# EAGLE design ESP32 IMU Module V1.1 (EAGLE 6.1)
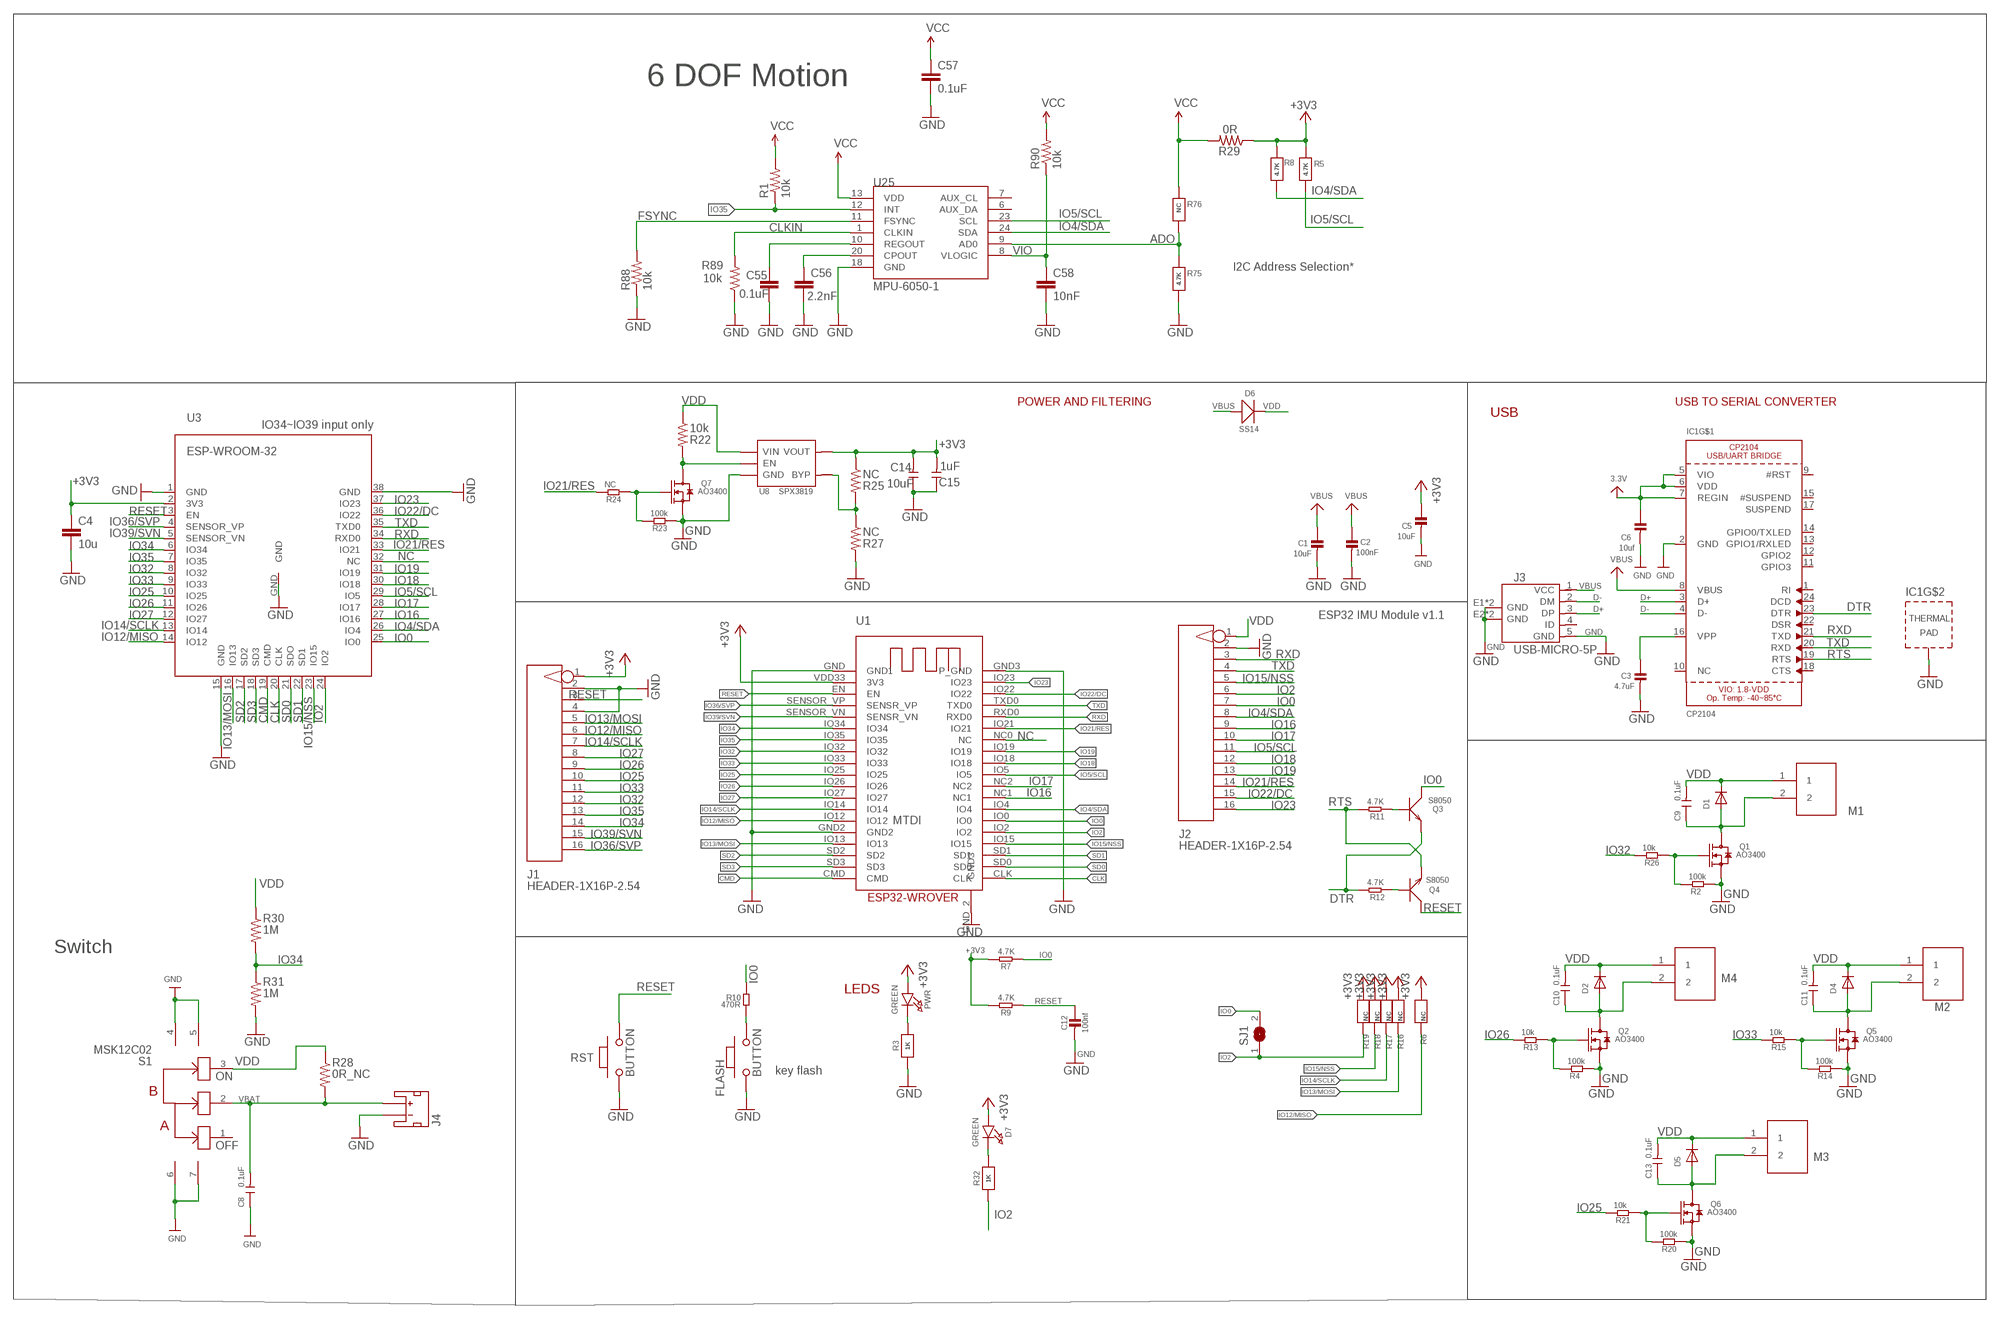
[diagram p0: schematic, sheet 1]

## Parts
C1  10uF  CAP_CERAMIC0603_NO  [0603-NO]
C2  100nF  CAP_CERAMIC0603_NO  [0603-NO]
C3  4.7uF  CAP_CERAMIC0603_NO  [0603-NO]
C4  10u  C-EUC0603  [C0603]
C5  10uF  CAP_CERAMIC0603_NO  [0603-NO]
C6  10uf  CAP_CERAMIC0603_NO  [0603-NO]
C8  0.1uF  C-0603  [0603]
C9  0.1uF  C-0603  [0603]
C10  0.1uF  C-0603  [0603]
C11  0.1uF  C-0603  [0603]
C12  100nf  CAP_CERAMIC0603_NO  [0603-NO]
C13  0.1uF  C-0603  [0603]
C14  10uF  C-0603  [0603]
C15  1uF  C-0603  [0603]
C55  0.1uF  CAP0603-CAP  [0603-CAP]
C56  2.2nF  CAP0603-CAP  [0603-CAP]
C57  0.1uF  CAP0603-CAP  [0603-CAP]
C58  10nF  CAP0603-CAP  [0603-CAP]
D1  DIODESOD-323F  [SOD-323F]
D2  DIODESOD-323F  [SOD-323F]
D4  DIODESOD-323F  [SOD-323F]
D5  DIODESOD-323F  [SOD-323F]
D6  SS14  D'0805'  [SOD323]
D7  GREEN  LED0805_NOOUTLINE  [CHIPLED_0805_NOOUTLINE]
FLASH  BUTTON  PB157  [157SW]
IC1  CP2104  [QFN24_4MM_SMSC]
J1  HEADER-1X16P-2.54  [DIP-1X16-2.54MM]
J2  HEADER-1X16P-2.54  [DIP-1X16-2.54MM]
J3  USB-MICRO-5P  [MICRO-USB-5P]
J4  JST_2MM_MALESMD  [JST-2-SMD]
M1  PH2.0-2P-90-DIP  [PH2.0-2P-90-DIP]
M2  PH2.0-2P-90-DIP  [PH2.0-2P-90-DIP]
M3  PH2.0-2P-90-DIP  [PH2.0-2P-90-DIP]
M4  PH2.0-2P-90-DIP  [PH2.0-2P-90-DIP]
PWR  GREEN  LED0805_NOOUTLINE  [CHIPLED_0805_NOOUTLINE]
Q1  AO3400  MOSFET-N'SOT23'  [SOT23@1]
Q2  AO3400  MOSFET-N'SOT23'  [SOT23@1]
Q3  S8050  TRANSISTOR-NPN-SOT23  [SOT23]
Q4  S8050  TRANSISTOR-NPN-SOT23  [SOT23]
Q5  AO3400  MOSFET-N'SOT23'  [SOT23@1]
Q6  AO3400  MOSFET-N'SOT23'  [SOT23@1]
Q7  AO3400  MOSFET-N'SOT23'  [SOT23@1]
R1  10k  RESISTOR0603-RES  [0603-RES]
R2  100k  R-0603  [R0603]
R3  1K  RESISTOR_0603_NOOUT  [0603-NO]
R4  100k  R-0603  [R0603]
R5  4.7K  RESISTOR_0603_NOOUT  [0603-NO]
R6  NC  RESISTOR_0603_NOOUT  [0603-NO]
R7  4.7K  R-0603  [R0603]
R8  4.7K  RESISTOR_0603_NOOUT  [0603-NO]
R9  4.7K  R-0603  [R0603]
R10  470R  R-0603  [R0603]
R11  4.7K  R-0603  [R0603]
R12  4.7K  R-0603  [R0603]
R13  10k  R-0603  [R0603]
R14  100k  R-0603  [R0603]
R15  10k  R-0603  [R0603]
R16  NC  RESISTOR_0603_NOOUT  [0603-NO]
R17  NC  RESISTOR_0603_NOOUT  [0603-NO]
R18  NC  RESISTOR_0603_NOOUT  [0603-NO]
R19  NC  RESISTOR_0603_NOOUT  [0603-NO]
R20  100k  R-0603  [R0603]
R21  10k  R-0603  [R0603]
R22  10k  RESISTOR0603-RES  [0603-RES]
R23  100k  R-0603  [R0603]
R24  NC  R-0603  [R0603]
R25  NC  RESISTOR0603-RES  [0603-RES]
R26  10k  R-0603  [R0603]
R27  NC  RESISTOR0603-RES  [0603-RES]
R28  0R_NC  RESISTOR0603-RES  [0603-RES]
R29  0R  RESISTOR0603-RES  [0603-RES]
R30  1M  RESISTOR0603-RES  [0603-RES]
R31  1M  RESISTOR0603-RES  [0603-RES]
R32  1K  RESISTOR_0603_NOOUT  [0603-NO]
R75  4.7K  RESISTOR_0603_NOOUT  [0603-NO]
R76  NC  RESISTOR_0603_NOOUT  [0603-NO]
R88  10k  RESISTOR0603-RES  [0603-RES]
R89  10k  RESISTOR0603-RES  [0603-RES]
R90  10k  RESISTOR0603-RES  [0603-RES]
RST  BUTTON  PB157  [157SW]
S1  MSK12C02  [SMD7-6.6X2.7X2.5MM]
SJ1  SJ  [SJ]
U1  ESP32-WROVER  [ESP32-WROVER]
U3  ESP-WROOM-32  [ESP-WROOM-32]
U8  SPX3819  [SOT23-5]
U25  MPU-6050-1  [QFN-24-4MM2]

## Nets
+3V3: C4.1 C5.1 C6.1 C14.2 C15.2 D7.A IC1.5(VIO) IC1.6(VDD) IC1.7(REGIN) J1.1 PWR.A R5.1 R6.1 R7.2 R8.1 R9.2 R16.1 R17.1 R18.1 R19.1 R25.1 R29.1 U1.VDD33(3V3) U3.2(3V3) U8.5(VOUT) ; supply symbol labelled 3.3V
ADO: R75.1 R76.2 U25.9(AD0)
CLK: U1.CLK U3.20(CLK)
CLKIN: R89.2 U25.1(CLKIN)
CMD: U1.CMD U3.19(CMD)
D+: IC1.3(D+) J3.3(DP)
D-: IC1.4(D-) J3.2(DM)
DTR: IC1.23(DTR) Q3.2(E) R12.2
FSYNC: R88.2 U25.11(FSYNC)
GND: C1.2 C2.2 C3.2 C4.2 C5.2 C6.2 C8.1 C12.2 C14.1 C15.1 C55.2 C56.2 C57.2 C58.2 FLASH.1 IC1.2(GND) IC1.THERM(TP) J1.2 J1.4 J2.2 J3.5(GND) J3.E1(GND) J3.E2(GND) J3.P1(GND) J3.P2(GND) J4.1(-) Q1.2(S) Q2.2(S) Q5.2(S) Q6.2(S) Q7.2(S) R2.1 R3.1 R4.1 R14.1 R20.1 R23.1 R27.2 R31.2 R75.2 R88.1 R89.1 RST.1 S1.4 S1.5 S1.6 S1.7 U1.GND2 U1.GND3(P_GND) U1.GND(GND1) U1.GND_2(GND3) U3.1(GND) U3.15(GND) U3.38(GND) U3.GND U8.2(GND) U25.18(GND)
IO0: J2.7 Q3.3(C) R7.1 R10.2 SJ1.2 U1.IO0 U3.25(IO0)
IO2: J2.6 R19.2 R32.1 SJ1.1 U1.IO2 U3.24(IO2)
IO4/SDA: J2.8 R8.2 U1.IO4 U3.26(IO4) U25.24(SDA)
IO5/SCL: J2.11 R5.2 U1.IO5 U3.29(IO5) U25.23(SCL)
IO12/MISO: J1.6 R6.2 U1.IO12 U3.14(IO12)
IO13/MOSI: J1.5 R16.2 U1.IO13 U3.16(IO13)
IO14/SCLK: J1.7 R17.2 U1.IO14 U3.13(IO14)
IO15/NSS: J2.5 R18.2 U1.IO15 U3.23(IO15)
IO16: J2.9 U1.NC1 U3.27(IO16)
IO17: J2.10 U1.NC2 U3.28(IO17)
IO18: J2.12 U1.IO18 U3.30(IO18)
IO19: J2.13 U1.IO19 U3.31(IO19)
IO21/RES: J2.14 R24.2 U1.IO21 U3.33(IO21)
IO22/DC: J2.15 U1.IO22 U3.36(IO22)
IO23: J2.16 U1.IO23 U3.37(IO23)
IO25: J1.10 R21.2 U1.IO25 U3.10(IO25)
IO26: J1.9 R13.2 U1.IO26 U3.11(IO26)
IO27: J1.8 U1.IO27 U3.12(IO27)
IO32: J1.12 R26.2 U1.IO32 U3.8(IO32)
IO33: J1.11 R15.2 U1.IO33 U3.9(IO33)
IO34: J1.14 R30.2 R31.1 U1.IO34 U3.6(IO34)
IO35: J1.13 R1.1 U1.IO35 U3.7(IO35) U25.12(INT)
IO36/SVP: J1.16 U1.SENSOR_VP(SENSR_VP) U3.4(SENSOR_VP)
IO39/SVN: J1.15 U1.SENSOR_VN(SENSR_VN) U3.5(SENSOR_VN)
N$1: C9.1 D1.A M1.2 Q1.3(D)
N$2: Q2.1(G) R4.2 R13.1
N$3: C10.1 D2.A M4.2 Q2.3(D)
N$4: Q1.1(G) R2.2 R26.1
N$5: PWR.C R3.2
N$6: Q5.1(G) R14.2 R15.1
N$7: C11.1 D4.A M2.2 Q5.3(D)
N$8: Q6.1(G) R20.2 R21.1
N$9: C13.1 D5.A M3.2 Q6.3(D)
N$10: Q7.3(D) R22.2 U8.3(EN)
N$11: Q7.1(G) R23.2 R24.1
N$12: D7.C R32.2
N$13: Q4.1(B) R12.1
N$14: Q3.1(B) R11.1
N$15: FLASH.2 R10.1
N$17: R25.2 R27.1 U8.4(BYP)
N$49: C56.1 U25.20(CPOUT)
N$50: C55.1 U25.10(REGOUT)
NC: U1.NC0(NC) U3.32(NC)
RESET: C12.1 J1.3 Q4.3(C) R9.1 RST.2 U1.EN U3.3(EN)
RTS: IC1.19(RTS) Q4.2(E) R11.2
RXD: IC1.21(TXD) J2.3 U1.RXD0 U3.34(RXD0)
SD0: U1.SD0 U3.21(SDO)
SD1: U1.SD1 U3.22(SD1)
SD2: U1.SD2 U3.17(SD2)
SD3: U1.SD3 U3.18(SD3)
TXD: IC1.20(RXD) J2.4 U1.TXD0 U3.35(TXD0)
VBAT: C8.2 J4.2(+) R28.2 S1.2
VBUS: C1.1 C2.1 D6.+ IC1.8(VBUS) J3.1(VCC)
VBUS1: C3.1 IC1.16(VPP)
VCC: C57.1 R1.2 R29.2 R76.1 R90.2 U25.13(VDD)
VDD: C9.2 C10.2 C11.2 C13.2 D1.C D2.C D4.C D5.C D6.- J2.1 M1.1 M2.1 M3.1 M4.1 R22.1 R28.1 R30.1 S1.3 U8.1(VIN)
VIO: C58.1 R90.1 U25.8(VLOGIC)
Unconnected: IC1.1(RI) IC1.9(#RST) IC1.10(NC) IC1.11(GPIO3) IC1.12(GPIO2) IC1.13(GPIO1/RXLED) IC1.14(GPIO0/TXLED) IC1.15(#SUSPEND) IC1.17(SUSPEND) IC1.18(CTS) IC1.22(DSR) IC1.24(DCD) J3.4(ID) S1.1 U25.6(AUX_DA) U25.7(AUX_CL)

## Notes on the sheet
- 6 DOF Motion
- I2C Address Selection*
- POWER AND FILTERING | USB TO SERIAL CONVERTER
- USB
- IO34~IO39 input only
- ESP32 IMU Module v1.1
- M1
- MTDI
- Switch
- M4
- LEDS
- M2
- key flash
- ON
- OFF
- M3

## Library data of the parts
C1-C3 C5 C6 C12 = microbuilder:CAP_CERAMIC: Ceramic Capacitors For new designs, use the packages preceded by an '_' character since they are more reliable: The following footprints should be used on most boards: _0402 - Standard footprint for regular board layouts _0603 - Standard footprint for regular board layouts _0805 - Standard footprint for regular board layouts _1206 - Standard footprint for regular board layouts For extremely tight-pitch boards where space is at a premium, the following 'micro-pitch' footprints can be used (smaller pads, no silkscreen outline, etc.): _0402MP - Micro-pitch footprint for very dense/compact boards _0603MP - Micro-pitch footprint for very dense/compact boards _0805MP - Micro-pitch footprint for very dense/compact boards _1206MP - Micro-pitch footprint for very dense/compact boards
C4 = rcl:C-EU: CAPACITOR, European symbol
C8-C11 C13-C15 = Discrete:C*: Ceramic Capacitors
C55-C58 = SparkFun:CAP: Capacitor Standard 0603 ceramic capacitor, and 0.1" leaded capacitor.
D1 D2 D4 D5 = adafruit:DIODE: Diode SMADIODE - SMA Surface Mount Package 20V 1A Schottky Diode Digikey: 641-1014-6-ND DO-1N4148 - Through Hole Small Current Diode SOD-123 20V 1 A (.5mV Vf) Schottky Diode - Digikey: MBRX120TPMSCT-ND SOD-323 10V 570mA (.38mV Vf, 3ns) Schottky Diode - Digikey: ZLLS410CT-ND SOD-523 30V 30mA Schottky Diode (RB751S-40TE61) - Digikey: RB751S-40TE61CT-ND SOT23-R/W - SOT23 Package (R = Solder Paste/Reflow Ovens, W = Hand-Soldering) BAT54Film 40V 300mA - Digikey: 497-7162-1-ND
D6 = Discrete:D*
D7 PWR = microbuilder:LED: LED 0603 - 0603 Surface Mount Package 2mA: Green LED - Low Power (3.9mcd, 2ma, 1.7Vf) - Digikey: 475-2709-2-ND Orange LED - Low Power (9.8mcd, 2ma, 1.8Vf) - Digikey: 475-1194-2-ND Red LED - Low Power (5mcd, 2ma, 1.8Vf) - Digikey: 475-1195-2-ND Yellow LED - Low Power (7mcd, 2ma, 1.8Vf) - Digikey: 475-1196-2-ND 5mA: Blue LED - Low Power (17mcd, 5ma, 2.9Vf) - Digikey: LNJ937W8CRACT-ND 0805 - 0805 Surface Mount Package 2mA: Red LED (8.8mcd, 2mA, 1.8Vf, Clear) - Low Power [Digikey: 475-2510-1-ND] Green LED (5mcd, 2mA, 1.8Vf, Clear) - Low Power [Digikey: 475-2730-1-ND] Yellow LED (11.3mcd, 2mA, 1.8Vf, Clear) - Low Power [Digikey: 475-2555-1-ND] 20mA: Red LED (104mcd, 20mA, Diffused) - LS R976 [Digikey: 475-1278-6-ND] Red LED (12mcd, 20mA, 2.0Vf, Clear) - APT2012EC [Digikey: 754-1128-1-ND] Green LED (15mcd, 20mA, 2.2Vf, Clear) - APT2012GC [Digikey: 754-1131-1-ND] Orange LED (160mcd, 20mA, 2.1Vf, Clear) - APT2012SECK [Digikey: 754-1130-1-ND] 1206 - 1206 Surface Mount Package Green LED (26mcd, 20mA, Diffused) - LG N971 [Digikey: 475-1407-6-ND] Red LED (15mcd, 20mA, Diffused) - LH N974 [Digikey: 475-1416-6-ND] Cree - Cree High-Power Surface Mount LEDs XPEBWT-L1-0000-00D50 - White 111lm 350mA 2.9Vf 6200K 110° XTEAWT-00-0000-00000LEE3 - White 114lm 350mA 2.85Vf 5000K 115° Everlight - Everlight 45-21 Series Surface Mount LEDs 45-21/QK2C-B2832AC2CB2/2T - Warm White 2000mcd 20mA 3.25Vf 3050K 120° 45-21/LK2C-B38452C4CB2/2T - Nuetral White 2000mcd 20mA 3.25Vf 4150K 120° 45-21/LK2C-B50634C6CB2/2T - Cold White 2200mcd 20mA 3.25Vf 5650K 120° PLCC2 Reverse Mount LS T77K-J1L2-1-0-2-R18-Z - Red 11.25mcd 2mA 1.8Vf 630nm 120° LO T77K-L1M2-24-Z - Orange 19.6mcd 2mA 1.8Vf 606nm 120° LY T77K-K2M1-26-Z - Yellow 15.7mcd 2mA 1.8Vf 587nm 120°
FLASH RST = MySMD:PB157
IC1 = microbuilder:CP2104: CP2104 - USB to UART Bridge VDD Output: 3.45V
J1 J2 = self:HEADER-1X16P-2.54
J3 = Connector:USB-MICRO-5P
J4 = SparkFun-Connectors:JST_2MM_MALE: JST 2MM MALE RA CONNECTOR Two pin, compact surface mount connector. Commonly used as a battery input connection point. We really like the solid locking feeling and high current rating on these small connectors. We use these all the time as battery connectors. Mates to single-cell LiPo batteries. Here is the connector we sell at SparkFun: JST Right Angle Connector - White <https://www.sparkfun.com/products/8612> (PRT-08612) Datasheet <http://www.sparkfun.com/datasheets/Prototyping/Connectors/JST-Horizontal.pdf> It was used on these SparkFun products: SparkFun MOSFET Power Controller <https://www.sparkfun.com/products/11214> (PRT-11214) SparkFun Battery Babysitter - LiPo Battery Manager <https://www.sparkfun.com/products/13777> (PRT-13777) And many, many others that required a lipo battery connection.; PROD_ID: CONN-11443; SF_ID: PRT-08612
M1-M4 = Connector:PH2.0-2P-90-DIP
Q1 Q2 Q5-Q7 = Discrete:MOSFET-N: IRLL014: http://www.vishay.com/docs/91319/sihll014.pdf
Q3 Q4 = Discrete:TRANSISTOR-NPN*: NPN audion
R1 R22 R25 R27-R31 R88-R90 = SparkFun:RESISTOR: Resistor Basic schematic elements and footprints for 0603, 1206, and PTH resistors.
R2 R4 R7 R9-R15 R20 R21 R23 R24 R26 = Discrete:R*
R3 R5 R6 R8 R16-R19 R32 R75 R76 = microbuilder:RESISTOR: Resistors For new designs, use the packages preceded by an '_' character since they are more reliable: The following footprints should be used on most boards: _0402 - Standard footprint for regular board layouts _0603 - Standard footprint for regular board layouts _0805 - Standard footprint for regular board layouts _1206 - Standard footprint for regular board layouts For extremely tight-pitch boards where space is at a premium, the following 'micro-pitch' footprints can be used (smaller pads, no silkscreen outline, etc.): _0402MP - Micro-pitch footprint for very dense/compact boards _0603MP - Micro-pitch footprint for very dense/compact boards _0805MP - Micro-pitch footprint for very dense/compact boards _1206MP - Micro-pitch footprint for very dense/compact boards
S1 = self:MSK12C02
SJ1 = jumper:SJ: SMD solder JUMPER
U1 = ESP32-Wrover:ESP32-WROVER
U3 = esp32:ESP-WROOM-32
U8 = IC:SPX3819
U25 = Testing:MPU-6050

## Net classes
0 default: width 0.203 mm, drill 0.305 mm, clearance 0.152 mm

## Board
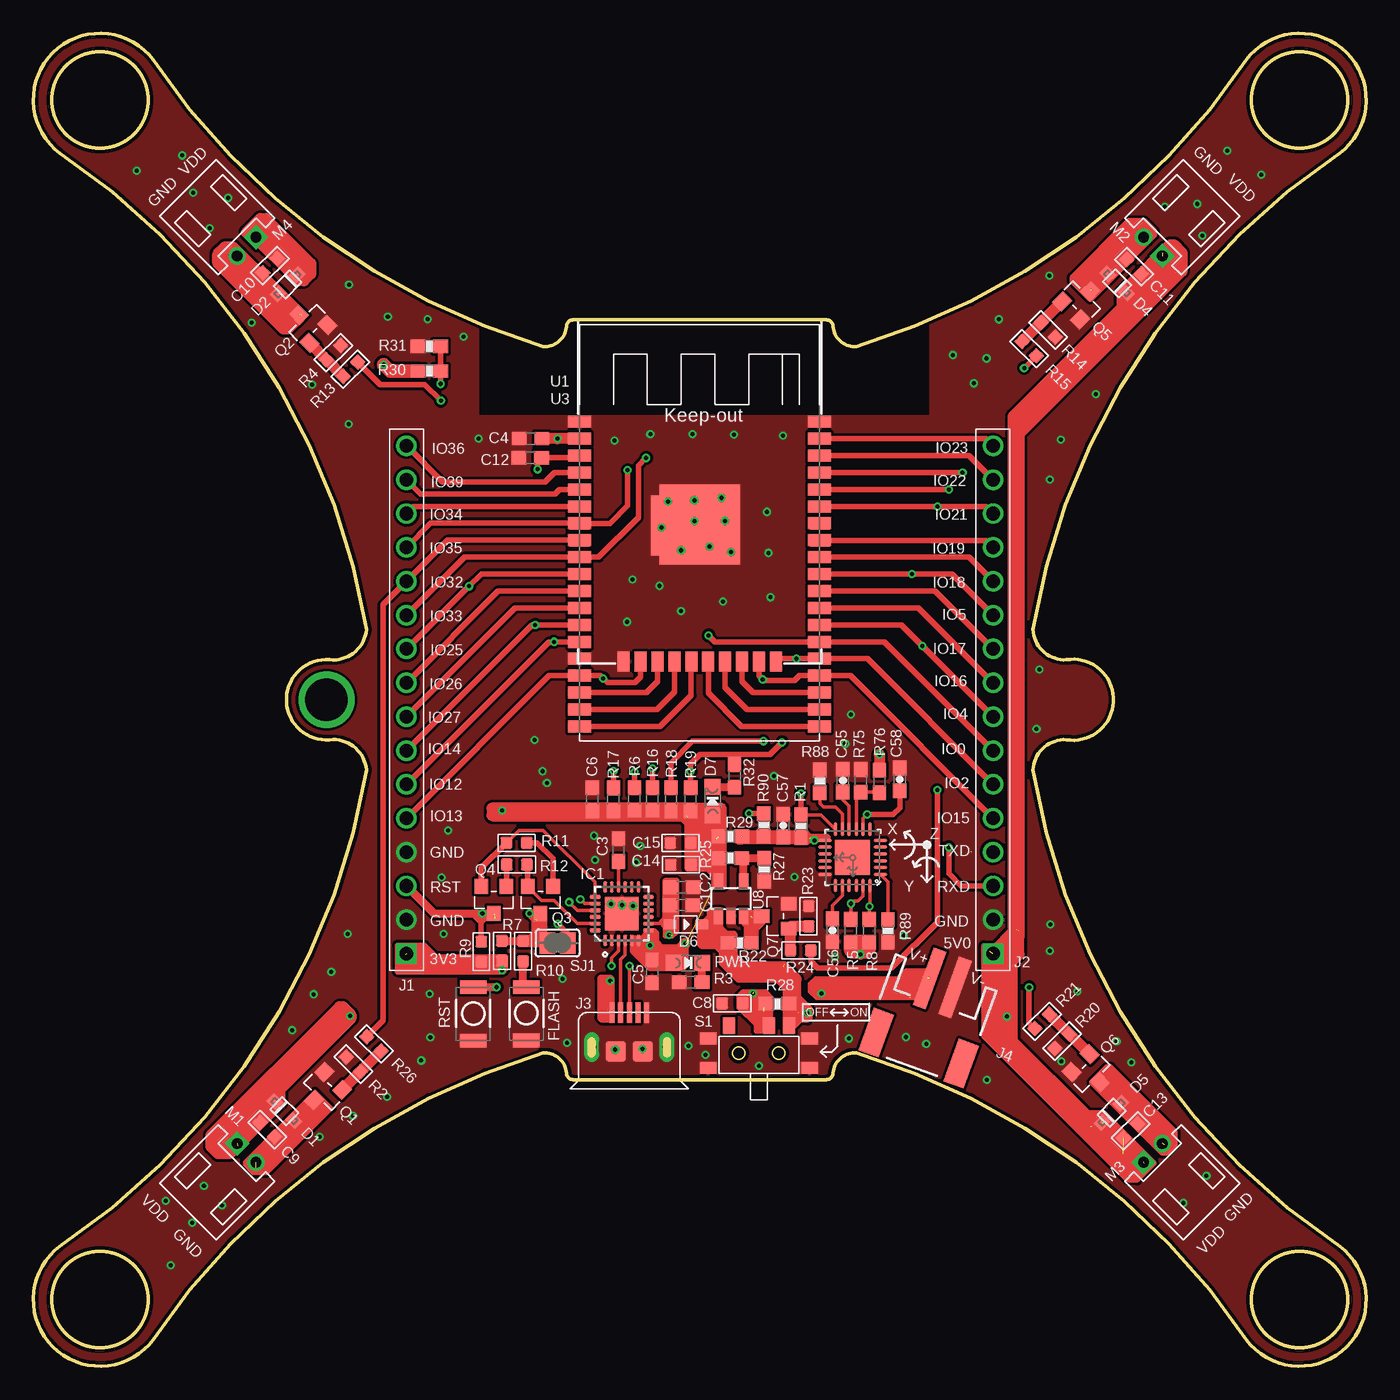
[diagram p1: board, top side]
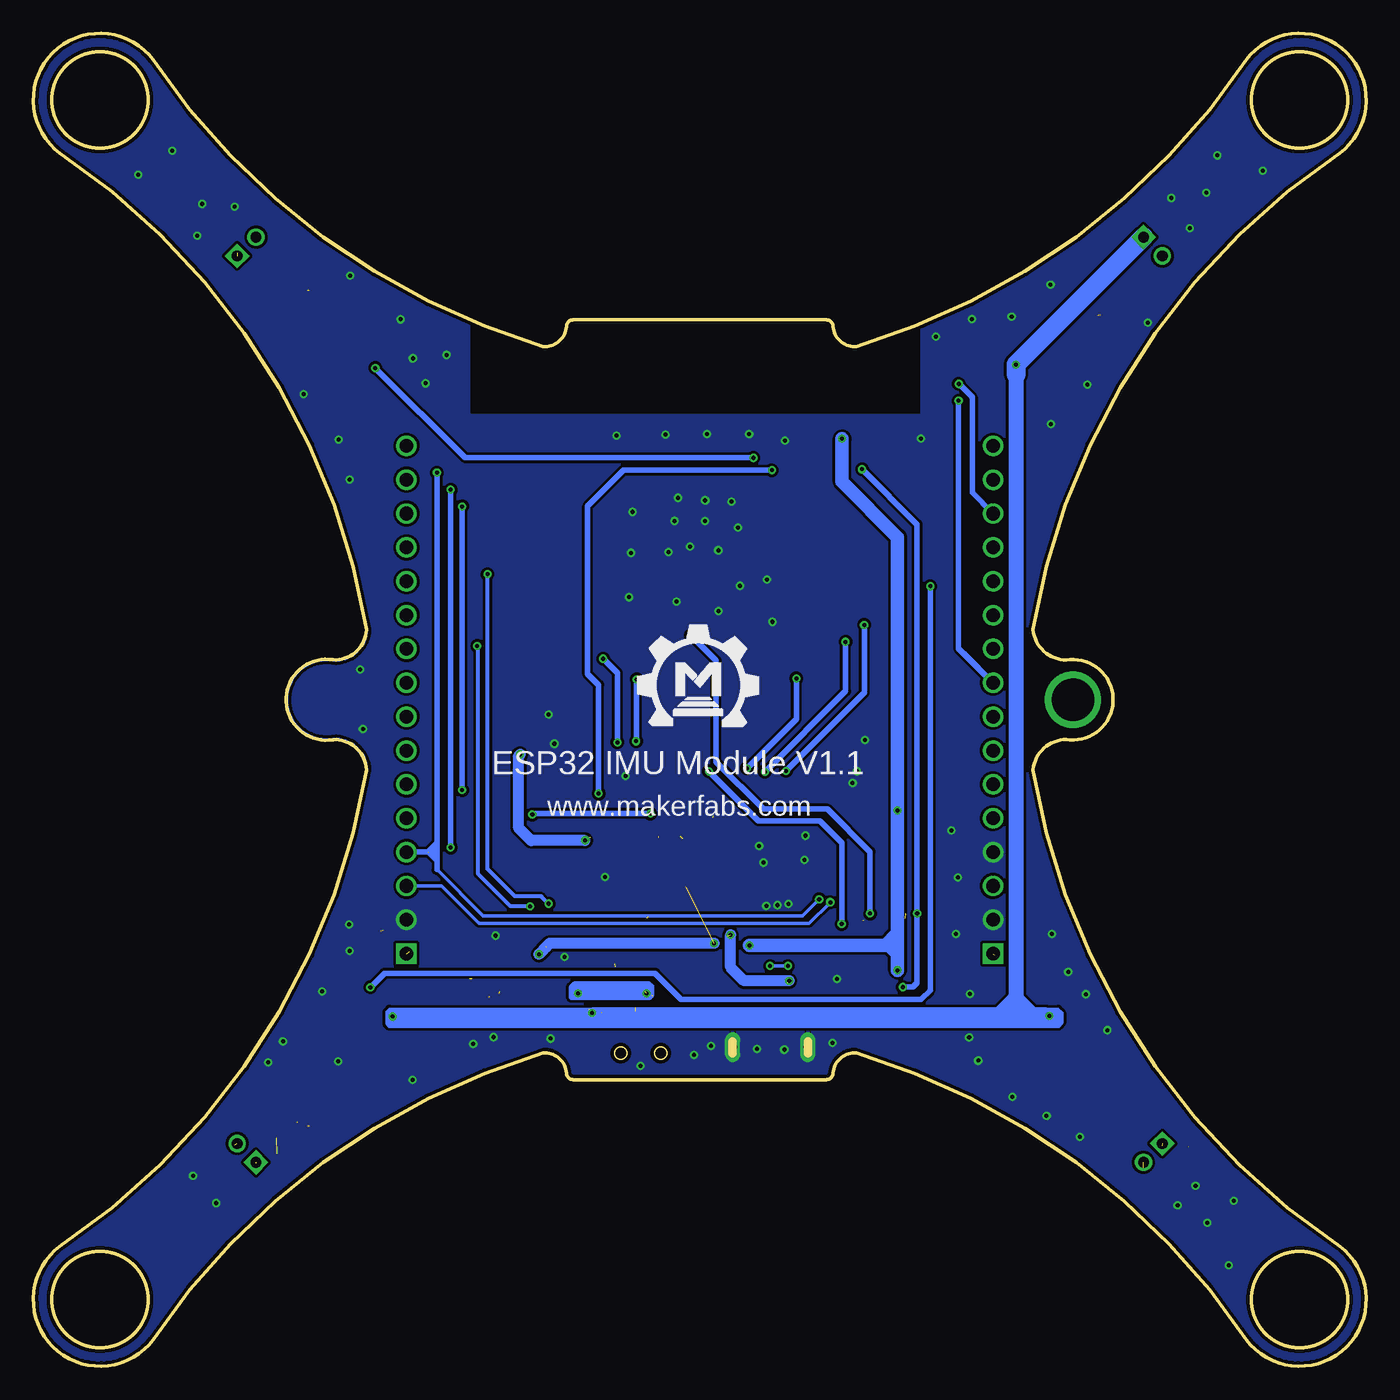
[diagram p2: board, bottom side, seen from below]

Size 100 x 100 mm. Coordinates in mm from the lower left corner, seen from the top.
Outline: 25,44.75 arc-47 2,9 arc196 9,2 arc-39 38.25,23.5 arc-90 40,22 arc90 40.5,21.5 59.5,21.5 arc90 60,22 arc-90 61.75,23.5 arc-39 91,2 arc196 98,9 arc-47 75,44.75 arc-90 77.5,47 arc199 77.5,53 arc-90 75,55.25 arc-47 98,91 arc196 91,98 arc-39 61.75,76.5 arc-90 60,78 arc90 59.5,78.5 40.5,78.5 arc90 40,78 arc-90 38.25,76.5 arc-39 9,98 arc196 2,91 arc-47 25,55.25 arc-90 22.25,53 arc190 22.25,47 arc-90 25,44.75
Outline: circle at 5,95 radius 3.6
Outline: circle at 95,95 radius 3.6
Outline: circle at 95,5 radius 3.6
Outline: circle at 5,5 radius 3.6
Copper layers (1*16): Top 0.035mm / dielectric 1.5mm / Bottom 0.035mm
Design rules: minimum track width 10mil, minimum drill 10mil, track to track 8mil, track to pad 8mil, pad to pad 8mil, via to via 8mil, smd to smd 0mil, copper to edge 10mil, drill to drill 8mil, minimum pad ring 10mil, minimum via ring 6mil, stop-mask expansion 4mil, vias tented up to drill 100mil, thermal gap 0mil
tRestrict: area 33.5,71.4 to 67.2,80.1
bRestrict: area 33.5,71.4 to 67.2,80.1

### Footprints (pad centres in the part's own frame; a part is rotated, then mirrored left to right if it is on the bottom)
0603-NO = smd 1.1 x 1: 1 -0.85,0; 2 0.85,0
C0603 = smd 1.1 x 1: 1 -0.85,0; 2 0.85,0
0603 = smd 0.889 x 0.889: 1 -0.762,0; 2 0.762,0
0603-CAP = smd 1.1 x 1: 1 -0.85,0; 2 0.85,0
SOD-323F = smd 1 x 0.8: A -1,0; C 1,0
SOD323 = smd 1 x 0.8: + -1.2,0; - 1.2,0
CHIPLED_0805_NOOUTLINE = smd 1.2 x 1.2: A 0,-1.05; C 0,1.05
157SW = smd 1.016 x 1.981: 1 0,0; 2 4,0
QFN24_4MM_SMSC = smd 0.8 x 0.28: 1 -2,1.25; 2 -2,0.75; 3 -2,0.25; 4 -2,-0.25; 5 -2,-0.75; 6 -2,-1.25; 13 2,-1.25; 14 2,-0.75; 15 2,-0.25; 16 2,0.25; 17 2,0.75; 18 2,1.25 | smd 0.28 x 0.8: 7 -1.25,-2; 8 -0.75,-2; 9 -0.25,-2; 10 0.25,-2; 11 0.75,-2; 12 1.25,-2; 19 1.25,2; 20 0.75,2; 21 0.25,2; 22 -0.25,2; 23 -0.75,2; 24 -1.25,2 | smd 2.5 x 2.5: THERM 0,0
DIP-1X16-2.54MM = drill 1.02 square: 1 -19.05,0 | drill 1.02: 2 -16.51,0; 3 -13.97,0; 4 -11.43,0; 5 -8.89,0; 6 -6.35,0; 7 -3.81,0; 8 -1.27,0; 9 1.27,0; 10 3.81,0; 11 6.35,0; 12 8.89,0; 13 11.43,0; 14 13.97,0; 15 16.51,0; 16 19.05,0
MICRO-USB-5P = smd 0.38 x 1.52: 1 -1.3,0; 2 -0.65,0; 3 0,0; 4 0.65,0; 5 1.3,0 | smd 1.524 x 1.524: E1 -1.016,-2.921; E2 1.016,-2.921 | drill 0.635 pad 1.143 long: P1 -2.819,-2.591; P2 2.819,-2.591
JST-2-SMD = smd 1 x 4.6: 1 -1,-3.7; 2 1,-3.7 | smd 1.6 x 3.4: NC1 -3.4,1.5; NC2 3.4,1.5
PH2.0-2P-90-DIP = drill 0.8 square: 1 0,1 | drill 0.8: 2 0,-1
SOT23@1 = smd 1.016 x 1.143: 1 -0.95,-1.016; 2 0.95,-1.016; 3 0,1.016
SOT23 = smd 1.016 x 1.143: 1 -0.95,-1.016; 2 0.95,-1.016; 3 0,1.016
0603-RES = smd 1.1 x 1: 1 -0.85,0; 2 0.85,0
R0603 = smd 0.889 x 0.889: 1 -0.762,0; 2 0.762,0
SMD7-6.6X2.7X2.5MM = smd 0.9 x 1.25: 1 2.25,-2.075; 2 -0.75,-2.075; 3 -2.25,-2.075 | smd 1.25 x 0.9: 4 3.8,-1.1; 5 3.8,1.1; 6 -3.8,1.1; 7 -3.8,-1.1
SJ = smd 1.168 x 1.6: 1 -0.762,0; 2 0.762,0
ESP32-WROVER = smd 1.7 x 0.9: CLK 18,1.27; CMD 0,1.27; EN 0,21.59; GND 0,24.13; GND3 18,24.13; GND_2 0,6.35; IO0 18,7.62; IO2 18,6.35; IO4 18,8.89; IO5 18,12.7; IO12 0,7.62; IO13 0,5.08; IO14 0,8.89; IO15 18,5.08; IO18 18,13.97; IO19 18,15.24; IO21 18,17.78; IO22 18,21.59; IO23 18,22.86; IO25 0,12.7; IO26 0,11.43; IO27 0,10.16; IO32 0,15.24; IO33 0,13.97; IO34 0,17.78; IO35 0,16.51; NC0 18,16.51; NC1 18,10.16; NC2 18,11.43; RXD0 18,19.05; SD0 18,2.54; SD1 18,3.81; SD2 0,3.81; SD3 0,2.54; SENSOR_VN 0,19.05; SENSOR_VP 0,20.32; TXD0 18,20.32; VDD33 0,22.86 | smd 4.5 x 4.5: GND2 7.62,16.34
ESP-WROOM-32 = smd 0.9 x 1.5: 1 7.7,9; 2 6.43,9; 3 5.16,9; 4 3.89,9; 5 2.62,9; 6 1.35,9; 7 0.08,9; 8 -1.19,9; 9 -2.46,9; 10 -3.73,9; 11 -5,9; 12 -6.27,9; 13 -7.54,9; 14 -8.81,9; 25 -8.81,-9; 26 -7.54,-9; 27 -6.27,-9; 28 -5,-9; 29 -3.73,-9; 30 -2.46,-9; 31 -1.19,-9; 32 0.08,-9; 33 1.35,-9; 34 2.62,-9; 35 3.89,-9; 36 5.16,-9; 37 6.43,-9; 38 7.7,-9 | smd 1.5 x 0.9: 15 -10.3,5.715; 16 -10.3,4.445; 17 -10.3,3.175; 18 -10.3,1.905; 19 -10.3,0.635; 20 -10.3,-0.635; 21 -10.3,-1.905; 22 -10.3,-3.175; 23 -10.3,-4.445; 24 -10.3,-5.715 | smd 6 x 6: GND 0,0
SOT23-5 = smd 0.69 x 1.2: 1 -0.95,-1.3; 2 0,-1.3; 3 0.95,-1.3; 4 0.95,1.3; 5 -0.95,1.3
QFN-24-4MM2 = smd 1.016 x 0.254: 1 -2.066,1.257; 2 -2.066,0.75; 3 -2.066,0.247; 4 -2.066,-0.287; 5 -2.066,-0.792; 6 -2.066,-1.297; 13 2.086,-1.297; 14 2.086,-0.792; 15 2.086,-0.287; 16 2.086,0.247; 17 2.086,0.75; 18 2.086,1.257 | smd 0.254 x 1.016: 7 -1.267,-2.122; 8 -0.762,-2.122; 9 -0.258,-2.122; 10 0.278,-2.122; 11 0.78,-2.122; 12 1.287,-2.122; 19 1.287,2.082; 20 0.78,2.082; 21 0.278,2.082; 22 -0.258,2.082; 23 -0.762,2.082; 24 -1.267,2.082 | smd 2.616 x 2.616: P$1 0.02,-0.01

### Placement (x,y rotation side)
C1  48.62,34.6 0 top
C2  48.66,35.94 0 top
C3  43.91,38.72 90 top
C4  37.31,69.59 180 top
C5  46.42,29.61 270 top
C6  41.93,42.54 90 top
C8  52.44,27.23 0 top
C9  17.55,17.75 135 top
C10  17.76,82.56 45 top
C11  82.58,82.49 315 top
C12  37.27,68.15 180 top
C13  82.32,17.65 225 top
C14  48.59,37.62 0 top
C15  48.55,39.25 0 top
C55  60.73,43.93 90 top
C56  59.95,32.7 270 top
C57  56.26,40.55 90 top
C58  65,44.03 90 top
D1  18.83,19.14 135 top
D2  19.07,81.17 45 top
D4  81.31,81.23 315 top
D5  80.89,19.01 225 top
D6  48.95,33.14 0 top
D7  50.97,42.39 0 top
FLASH  37,24.44 90 top
IC1  44.15,33.95 90 top
J1  28,50 90 top
J2  72,50 90 top
J3  44.71,26.53 0 top
J4  66.94,25.28 160 top
M1  16,16 45 top
M2  84,84 225 top
M3  84,16 135 top
M4  16,84 315 top
PWR  49.13,30.25 270 top
Q1  21.78,20.68 135 top
Q2  20.66,78.17 45 top
Q3  38.04,34.97 180 top
Q4  34.55,34.98 180 top
Q5  78.58,79.93 315 top
Q6  79.29,22.03 225 top
Q7  55.66,33.76 90 top
R1  57.6,40.52 270 top
R2  24.01,22.65 315 top
R3  49.32,28.81 0 top
R4  22.52,76.04 225 top
R5  61.33,32.67 90 top
R6  45.1,42.55 90 top
R7  35.16,31.15 270 top
R8  62.72,32.67 90 top
R9  33.61,31.09 270 top
R10  36.74,31.14 90 top
R11  36.25,39.27 180 top
R12  36.27,37.63 0 top
R13  23.79,74.8 45 top
R14  76.13,77.75 135 top
R15  74.71,76.34 315 top
R16  46.45,42.55 90 top
R17  43.53,42.53 90 top
R18  47.85,42.55 90 top
R19  49.32,42.55 90 top
R20  77.18,24.38 45 top
R21  75.68,25.87 225 top
R22  53,31.75 0 top
R23  58.17,33.77 270 top
R24  57.57,31.19 0 top
R25  52.3,38.12 0 top
R26  25.55,24.18 135 top
R27  54.83,37.25 270 top
R28  55.82,27.19 180 top
R29  52.29,39.75 0 top
R30  29.71,74.66 0 top
R31  29.71,76.51 180 top
R32  52.61,44.29 270 top
R75  62.07,43.92 90 top
R76  63.48,43.87 270 top
R88  59.01,43.88 270 top
R89  64.12,32.66 90 top
R90  54.81,40.6 270 top
RST  33,24.43 90 top
S1  54.43,23.48 180 top
SJ1  39.33,31.75 180 top
U1  40.98,46.73 0 top
U3  50,63.15 90 top
U8  52.34,35.09 0 top
U25  61.48,38.16 180 top
U$1  [MAKERFABS_0.3]  54.23,48.02 0 bottom

### Tracks (layer width: path | path; a pad name or v marks a point on that pad's centre or on a via)
+3V3  (via drill 0.3)  (5 unrouted)
  Top 0.254: IC1.5 IC1.6 45.83,31.95 45.89,31.9 46.15,32.16 IC1.7 | 51.08,35.96 51.08,36.79 51.39,37.11 | v48.93,31.72 48.93,31.49 48.52,31.08 | D7.A 49.74,41.34 49.72,41.32
  Top 0.406: J1.1 28.62,30.33 R9.2 33.67,30.39 R7.2 v35.16,29.71 | U3.2 U1.VDD33 | 27.32,31.57 27.32,29.6 35.24,29.6 35.43,29.79 35.43,30.7 30.19,30.7 29.32,31.57 27.32,31.57 | 27.32,31.57 27.68,31.21 29.18,31.21 30.35,30.04 34.8,30.04 34.99,29.85 35.11,29.85 35.08,29.82 27.61,29.82 27.6,29.83 27.6,31.15 27.91,30.84 29.12,30.84 29.85,30.11 30.05,30.11 30.02,30.14 27.92,30.14 27.95,30.17 27.95,30.6 28.11,30.44 29.06,30.44 | 44.98,32.1 45.03,32.15 45.69,32.15 45.96,32.42 45.96,32.64 46.56,32.64 46.74,32.46 46.74,31.86 47.13,31.47 48.94,31.47 48.96,31.45 48.96,30.11 48.7,29.85 46.26,29.85 44.97,31.14 44.97,32.05 45.33,31.69 45.33,31.23 46.35,30.21 48.66,30.21 48.66,31.22 48.52,31.08 48.38,30.94 45.94,30.94 45.6,31.28 45.6,31.74 46.07,31.27 46.1,31.27 46.38,31.55 46.38,32.36 46.6,32.14 46.6,31.65 47.01,31.24 | 47.01,31.24 48.09,31.24 | 47.01,31.24 46.63,31.24 | 49.4,41.73 49.61,41.52 49.61,41.09 50.65,40.05 51.79,40.05 51.8,40.04 51.8,35.96 51.08,35.96 51.08,36.86 50.62,37.32 49.1,37.32 49.04,37.38 49.04,40.72 48.27,41.49 48.59,41.49 48.92,41.16 49.03,41.16 50.47,39.72 50.82,39.72 50.84,39.7 50.87,39.7 50.89,39.68 50.89,37.37 50.95,37.31 50.95,37.4 50.7,37.65 49.87,37.65 49.86,37.64 49.86,39.98 49.76,40.08 49.76,39.93 50.2,39.49 50.54,39.49 50.55,39.48 50.55,38.64 50.59,38.6 50.21,38.6 50.2,38.59 50.2,39.22 50.13,39.29
  Top 0.61: 48.08,30.8 PWR.A 47.86,30.46 C5.1 46.42,31.43 v46.28,31.58 46.21,31.58 45.89,31.9 | 48.67,41.77 48.88,41.98 51.63,41.98 51.7,41.91 51.7,39.13 51.27,39.56 51.27,40.58 51.2,40.51 50.53,40.51 50.23,40.81 50.23,41.59
  Top 0.813: U1.VDD33 v39.33,69.59 C4.1 | v35.16,41.69 C6.1 43.51,41.69 R17.1 45.07,41.68 R6.1 R16.1 R18.1 R19.1 C15.2 49.35,39.21 49.35,38.14 | v35.16,41.69 | C14.2 49.35,38.14 | U8.5 51.39,37.11 51.39,38.06 R25.1 | R25.1 R29.1 | R25.1 49.37,38.12 49.35,38.14 | R8.1 R5.1 61.33,31.64 v62.06,30.91 | 48.08,30.8 48.08,30.87 v48.93,31.72 | 61.42,31.75 61.64,31.97 62.81,31.97 62.82,31.96 62.82,31.31 62.49,30.98 61.41,30.98 61.24,31.15 61.24,31.67 61.48,31.43 62.03,31.43 | 34.46,41.29 49.02,41.29 49.72,40.59 49.72,41.32 49.72,41.85 49.69,41.88 34.41,41.88 34.41,41.32 34.43,41.3
  Bottom 0.813: 61.53,31.44 v62.06,30.91 61.25,31.72 v48.93,31.72
  Bottom 1.016: v39.33,69.59 39.33,66.35 35.16,62.18 35.16,32.49 | 36.08,31.57 35.79,31.57 35.16,30.94 v35.16,29.71 35.16,32.49 | 36.08,31.57 v46.27,31.57 v46.28,31.58 | 36.08,31.57 35.16,32.49
ADO
  Top 0.254: U25.9 61.74,42.74 R75.1 63.42,43.07 R76.2
CLK
  Top 0.406: U1.CLK 53.13,48 50.64,50.49 U3.20
CLKIN
  Top 0.254: R89.2 64.12,36.33 U25.1
CMD
  Top 0.406: U1.CMD 47.04,48 49.36,50.32 U3.19
D+  (via drill 0.3)
  Top 0.254: J3.3 v44.71,30.01 v44.72,30.02 | v43.39,30.02 43.39,30.64 43.9,31.15 IC1.3
  Bottom 0.254: v44.72,30.02 v43.39,30.02
D-
  Top 0.254: J3.2 44.06,30.53 44.4,30.87 IC1.4
DTR
  Top 0.254: IC1.23 40.82,33.2 39.08,34.95 38.13,34.95 Q3.2
  Top 0.406: Q3.2 37.09,37.58 R12.2
FSYNC
  Top 0.254: U25.11 60.7,41.43 60.19,41.95 59.29,41.95 59.03,42.21 59.03,43.01 R88.2
GND  (via drill 0.3)
  Top 0.254: v45.01,34.52 44.94,34.59 v44.17,34.59
  Top 0.813: J2.2
  other vias: 76.31,33.14 76.26,31.16 78.33,28.11 77.12,22.87 81.27,24.36 82.39,22.79 86.27,12.24 88.02,14.27 65.47,24.69 71.55,21.49 66.99,24.18 54.45,22.54 61.18,24.58 49.16,24.03 50.42,23.37 40.05,24.26 39.72,29.05 43.33,34.67 45.21,37.78 42.08,39.8 42.14,37.98 45.54,39.03 38.53,43.76 37.6,46.97 55.56,44.27 61.33,48.88 60.91,46.7 57.12,36.72 65.31,32.3 60.13,30.72 75.49,52.26 75.27,47.82 71.52,75.61 68.99,75.87 72.44,78.54 70.56,73.74 77.08,69.51 76.28,66.51 79.72,72.93 89.57,91.19 92.13,89.38 87.34,87.2 84.88,87 76.24,81.81 87.7,84.82 7.75,89.7 11.18,90.84 14.61,87.65 11.99,88.03 13.23,85.37 16.39,78.3 20.93,73.63 23.66,70.67 23.68,81.14 26.6,78.75 32.29,77.24 29.59,78.55 33.4,69.6 50.72,61.5 51.9,63.42 49.59,64.96 47.14,62.93 49.6,63.41 51.64,65.15 55.04,64.1 55.15,61.02 55.32,57.69 48.59,56.65 44.53,55.85 44.96,59.03 51.73,57.38 48.61,61.21 52.35,61.09 47.62,64.88 46.98,58.55 43.6,69.45 46.29,69.94 49.46,69.94 52.56,69.88 56.25,69.83 38.2,44.64 30.63,36.67 31.13,40.2 30.79,32.42 23.58,32.42 22.36,29.58 19.42,25.21 29.11,22.93 29.73,27.94 29.79,24.68 26.54,20.22 23.98,18.77 21.47,17.22 14.15,12.07 12.8,13.54 9.93,12.42 10.3,7.56 11.93,10.75 21.04,27.91 43.66,23.75 45.72,23.82
  pour Top: 41.49,136.22 109.29,137.57 109.85,-11.97 -7.07,-13.17 -7.99,136.36
  pour Bottom: -8.06,136.59 110.37,137.11 111.74,-11.93 -6.69,-12.45
IO0  (via drill 0.3)  (1 unrouted)
  Top 0.406: U3.25 63.85,54.34 J2.7 | v37.22,33.96 | v50.66,54.82 51.13,54.35 U1.IO0
  Top 0.61: U1.IO0 U3.25 | R7.1 35.17,31.9 R10.2 36.9,31.75 37.74,31.75 | 37.74,31.75 SJ1.2 | Q3.3 v37.22,33.96 | v37.22,33.96 37.74,33.44 37.74,31.75 | 36.69,31.98 37.2,31.98 37.69,32.47 37.69,33.47 38.24,34.02 38.24,32.29 38.25,32.28
  Bottom 0.406: v37.22,33.96 37.22,38.6 40.41,41.79 45.21,41.79 48.77,45.35 48.77,52.93 v50.66,54.82
IO2  (via drill 0.3)
  Top 0.254: R32.1 52.61,45.88 52.62,45.89
  Top 0.406: J2.6 62.57,53.08 U1.IO2 v57.25,53.08 55.94,53.08 U3.24 | v56.18,46.8 55.27,45.89 52.62,45.89 50.02,45.89 49.32,45.19 v49.32,44.63 R19.2 | SJ1.1 40.09,32.44 v39.35,33.18
  Bottom 0.406: v56.18,46.8 56.18,52.01 v57.25,53.08 | v39.35,33.18 39.35,39.27 40.99,40.91 45.6,40.91 v49.32,44.63
IO4/SDA  (via drill 0.3)
  Top 0.254: U25.24 v62.75,34.51 v62.74,34.5 62.74,33.54 R8.2
  Top 0.406: J2.8 v66.7,54.03 65.12,55.61 U3.26 U1.IO4
  Bottom 0.305: v62.74,34.5 64.19,34.5 66.62,36.93 66.62,53.95 v66.7,54.03
IO5/SCL  (via drill 0.3)
  Top 0.254: U25.23 62.24,35.28 61.87,34.91 61.54,34.91 v61.33,34.7 R5.2
  Top 0.406: J2.11 68.93,59.42 v65.93,59.42 U3.29 U1.IO5
  Bottom 0.305: v61.33,34.7 61.89,35.26 63.87,35.26 65.93,37.32 v65.93,59.42
IO12/MISO  (via drill 0.3)
  Top 0.406: J1.6 38.7,54.35 v39.06,54.35 U1.IO12 U3.14 | R6.2 v45.1,44.58 v45.11,44.59
  Bottom 0.406: v45.11,44.59 39.06,50.64 v39.06,54.35
IO13/MOSI  (via drill 0.3)
  Top 0.406: J1.5 38.7,51.81 U1.IO13 42.54,51.81 v42.75,51.59 43.07,51.28 43.21,51.28 45.13,51.28 45.55,51.7 U3.16 | R16.2 46.45,44.83 v46.47,44.85
  Bottom 0.406: v46.47,44.85 42.75,48.56 v42.75,51.59
IO14/SCLK  (via drill 0.3)
  Top 0.406: J1.7 37.42,55.61 v37.66,55.61 U3.13 U1.IO14 | R17.2 v43.53,44.67
  Bottom 0.406: v43.53,44.67 37.66,50.54 v37.66,55.61
IO15/NSS  (via drill 0.3)
  Top 0.406: U3.23 54.45,51.8 v54.72,51.52 54.81,51.44 55.19,51.44 57.1,51.44 57.47,51.81 U1.IO15 61.3,51.81 J2.5 | R18.2 47.85,45.27 49.47,46.89 v54.77,46.89
  Bottom 0.406: v54.77,46.89 54.72,46.93 v54.72,51.52
IO16
  Top 0.406: J2.9 66.39,56.88 U3.27 U1.NC1
IO17
  Top 0.406: J2.10 67.66,58.15 U3.28 U1.NC2
IO18
  Top 0.406: J2.12 70.2,60.69 U3.30 U1.IO18
IO19
  Top 0.406: J2.13 71.47,61.96 U3.31 U1.IO19
IO21/RES  (via drill 0.3)
  Top 0.406: J2.14 71.47,64.5 v67.83,64.5 U3.33 U1.IO21 | v67.82,43.22 67.82,33.31 64.39,29.88 58.83,29.88 58.33,30.38 R24.2
  Bottom 0.406: v67.82,43.22 v67.82,64.49 v67.83,64.5
IO22/DC
  Top 0.406: J2.15 70.2,68.31 U3.36 U1.IO22
IO23
  Top 0.406: J2.16 71.47,69.58 U3.37 U1.IO23
IO25  (via drill 0.3)
  Top 0.406: U3.10 U1.IO25 33.62,59.43 v32.7,58.51 J1.10 | R21.2 74.71,25.76 v74.71,28.43
  Bottom 0.406: v32.7,58.51 v32.71,58.51 32.71,28.21 33.39,27.53 51.39,27.53 53.34,29.48 73.66,29.48 v74.71,28.43
IO26  (via drill 0.3)
  Top 0.406: J1.9 34.89,58.16 U1.IO26 U3.11 | R13.2 26.01,73.66 29.37,73.66 v30.58,72.45 v30.58,72.44
  Bottom 0.406: 30.19,53.46 J1.9 30.58,53.85 v30.58,72.44
IO27
  Top 0.406: J1.8 36.16,56.89 U1.IO27 U3.12
IO32
  Top 0.406: R26.2 26.24,25.94 26.24,57.14 J1.12 31.08,61.97 U1.IO32 U3.8
IO33  (via drill 0.3)
  Top 0.406: J1.11 32.35,60.7 U1.IO33 U3.9 42.41,60.7 45.39,63.68 45.39,67.56 v45.98,68.15 | R15.2 v74.34,74.89 | v74.34,74.89
  Bottom 0.406: v74.34,74.89 67.6,68.15 v45.98,68.15
IO34  (via drill 0.3)
  Top 0.406: J1.14 28.54,64.51 U1.IO34 U3.6 | R31.1 R30.2 | v30.56,73.7 30.56,74.64 30.54,74.66 R30.2 | R30.2
  Bottom 0.406: J1.14 29.56,65.53 29.56,72.7 v30.56,73.7
IO35  (via drill 0.3)
  Top 0.254: U25.12 59.1,41.37 R1.1
  Top 0.406: J1.13 29.81,63.24 U1.IO35 U3.7 | R1.1 v57.6,42.96 v57.59,42.97 | U3.7 | U3.7 43.27,63.23 44.59,64.55 v44.59,67.22
  Bottom 0.406: v57.59,42.97 57.59,51.12 58.4,51.93 58.4,64.54 55.72,67.22 v44.59,67.22
IO36/SVP
  Top 0.406: J1.16 30.72,66.33 38.4,66.33 39.12,67.05 U1.SENSOR_VP U3.4
IO39/SVN
  Top 0.406: J1.15 29.07,65.44 39.13,65.44 39.47,65.78 U1.SENSOR_VN U3.5
N$1  (1 unrouted)
  Top 0.254: 17.51,14.48 16.47,14.48 15.85,15.1 15.85,15.33 21.14,20.62 22.42,19.34 17.56,14.48 17.51,14.48 | 17.51,14.48 17.31,14.68 16.56,14.68 16.05,15.19 16.28,15.42 16.28,15.52
  Top 0.406: 16.28,15.52 16.28,15.33 16.72,14.89
  Top 0.813: M1.2 16.71,15.61 18.31,17.21 | Q1.3 18.35,17.25 18.31,17.21 | D1.A 18.31,17.21 C9.1 18.31,17.21 | 16.72,14.89 16.88,14.89 21.62,19.63 21.91,19.34 17.48,14.91 17.46,14.91
N$2
  Top 0.813: Q2.1 | Q2.1 R4.2 22.01,75.51 R13.1
N$3  (1 unrouted)
  Top 0.813: M4.2 16.95,81.63 | 16.95,81.63 18.35,80.23 | 18.35,80.23 19.7,78.88 Q2.3 | D2.A 18.35,80.45 18.35,80.23 | C10.1 16.95,81.75 16.95,81.63 | 13.85,83.46 14.38,83.99 14.97,83.99 20.12,78.84 20.13,78.84 19.1,77.81 18.77,77.81 13.84,82.74 13.84,83.44 13.93,83.35 14.56,83.35 19.18,78.73 19.37,78.73 19.05,78.41 18.99,78.41 14.42,82.98 14.42,83.04
N$4
  Top 0.813: Q1.1 R2.2 24.56,22.11 R26.1
N$5
  Top 0.61: R3.2 50.17,30.23 PWR.C
N$6
  Top 0.813: Q5.1 R14.2 R15.1
N$7  (1 unrouted)
  Top 0.406: 79.65,80.73 79.41,80.73 79.05,80.37 77.95,81.47 | 77.95,81.47 77.95,81.66 | 77.95,81.66 77.95,81.67 82.21,85.93 83.32,85.93 84.11,85.14 84.11,84.89 79.29,80.07 77.95,81.41 77.95,81.47 | 77.95,81.66 78.1,81.51 78.89,81.51
  Top 0.813: M2.2 81.79,83.2 | 81.79,83.2 80.52,81.94 | Q5.3 79.3,80.71 80.52,81.94 | 80.52,81.94 D4.A | C11.1 81.86,83.2 81.79,83.2
  Top 1.27: 78.89,81.51 82.6,85.22 83,85.22 83.18,85.04 83.36,85.04
N$8
  Top 0.813: Q6.1 79.22,23.42 R20.2 77.71,24.92 R21.1
N$9  (1 unrouted)
  Top 0.406: 79.9,21.04 79.79,21.15 79.79,21.6 80.61,22.42 80.81,22.42 85.65,17.58 85.65,16.64 85.01,16 84.71,16 79.43,21.28 80.59,22.44 80.79,22.44 80.64,22.29 80.64,21.74
  Top 0.813: M3.2 84.61,16.71 D5.A | Q6.3 80.44,20.88 D5.A | C13.1 82.86,18.46 D5.A
  Top 1.016: 80.64,21.74 85.12,17.26 85.12,16.83 84.9,16.61 84.9,16.5
N$10  (1 unrouted)
  Top 0.254: U8.3 53.8,33.79 | 53.8,33.79 54.62,33.79 Q7.3 | R22.2 53.85,33.73 53.8,33.79
  Top 0.406: 53.41,34.13 53.48,34.06 54.69,34.06 54.69,33.31 54.2,32.82 54.2,31.78 53.58,31.78 53.51,31.85 53.51,33.04 53.16,33.39 53.31,33.39 53.56,33.64 53.97,33.64 53.97,33.37 54.2,33.14 54.2,33.07 53.81,32.68 53.81,32.25 53.82,32.24 53.82,33.36 53.64,33.54
N$11
  Top 0.813: R24.1 56.81,32.68 Q7.1 56.87,33.01 R23.2
N$12
  Top 0.61: D7.C R32.2
N$13
  Top 0.406: Q4.1 R12.1
N$14
  Top 0.406: R11.1 37.8,39.27 38.99,38.08 Q3.1
N$15
  Top 0.61: FLASH.2 36.74,28.77 R10.1
N$17
  Top 0.61: U8.4 53.29,37.98 R25.2 53.17,38.1 R27.1
N$18
  Bottom 0.254: 75,55.25 arc96 77.75,53 arc-190 77.75,47 arc96 75,44.75
N$24
  Bottom 0.254: 22.25,47 arc-190 22.25,53
N$49
  Top 0.254: U25.20 60.7,35.31 59.95,34.56 C56.1
N$50
  Top 0.254: U25.10 61.2,42.01 60.73,42.49 C55.1
N$53  (via drill 3.2)
  other vias: 22,50
NC
  Top 0.406: U3.32 U1.NC0
RESET  (via drill 0.3)  (1 unrouted)
  Top 0.406: 33.56,33.97 Q4.3 | R9.1 33.61,33.92 33.56,33.97 | v33.69,33.96 33.56,33.97 | U3.3 U1.EN 40.81,68.15 C12.1 37.82,67.85 v37.82,67.29 | RST.2 33.46,28.44 | 32.99,33.95 33.59,33.35 33.59,33.33 33.86,33.6 34.61,33.6
  Top 0.61: J1.3 30.06,33.97 Q4.3 | 33.46,28.44 v34.76,28.44
  Bottom 0.406: v37.82,67.29 33.69,63.16 v33.69,33.96 33.69,28.76 34.01,28.44 v34.76,28.44
RTS
  Top 0.254: IC1.19 42.15,36.32 38.26,40.21 36.43,40.21 R11.2
  Top 0.406: Q4.2 33.6,37.37 R11.2
RXD  (via drill 0.3)
  Top 0.254: IC1.21 40.81,34.2 v40.21,34.81
  Top 0.406: v68.68,65.76 v68.67,65.77 U3.34 U1.RXD0 | v68.68,38.92 68.68,36.96 69.61,36.03 J2.3
  Bottom 0.254: v40.21,34.81 41.79,33.23 66.55,33.23 69.35,36.03 J2.3
  Bottom 0.406: v68.68,65.76 v68.68,38.92
SD0
  Top 0.406: U1.SD0 53.54,49.27 51.91,50.9 U3.21
SD1
  Top 0.406: U1.SD1 53.99,50.54 53.18,51.35 U3.22
SD2
  Top 0.406: U1.SD2 46.02,50.54 46.83,51.35 U3.17
SD3
  Top 0.406: U1.SD3 46.78,49.27 48.09,50.58 U3.18
TXD  (via drill 0.3)  (1 unrouted)
  Top 0.254: IC1.20 41.36,34.7 v41.04,35.03
  Top 0.406: v69.72,67.04 U3.35 U1.TXD0 | v69.72,67.04
  Bottom 0.254: v41.04,35.03 42.28,33.79 66.25,33.79 69.72,37.26
  Bottom 0.406: v69.72,67.04 69.72,39.25 69.72,39.24 | 69.72,39.24 69.72,38.71 | 69.72,38.71 69.72,37.26 | J2.4 69.86,38.57 69.72,38.71 | 70.39,38.57 69.72,39.24 | 70.34,38.59 69.73,37.98 69.73,37.97
VBAT  (via drill 0.3)  (6 unrouted)
  Top 0.254: 65.01,28.1 65.53,27.58 67.08,27.58 67.08,29.11 67.59,29.62 67.49,29.72 65.46,29.72 64.6,28.86 64.6,28.83 65.29,29.52 66.86,29.52 66.86,29.33 66.56,29.03 66.56,28.58 66.34,28.36 66.34,27.94 66.12,27.72 65.8,27.72 65.61,27.91 65.61,28.17 65.39,28.39 65.73,28.39 65.85,28.27 65.85,28.11 65.76,28.02 65.77,28.02 66.39,28.64 66.39,28.95 66.38,28.96
  Top 0.406: 55.4,25.22 55.32,25.14 54.24,25.14 54.24,25.64 52.96,26.92 52.96,27.75 53.29,28.08 54.92,28.08 55.32,27.68 55.32,25.72 55.05,25.45 54.6,25.45 54.6,25.66 53.51,26.75 53.51,27.33 53.25,27.59 53.34,27.59 53.53,27.78 54.97,27.78 55.01,27.74 53.94,27.74 53.72,27.52 53.72,26.96 54.72,25.96 54.72,26.51 54.83,26.62 54.53,26.62 54.2,26.95 | 66.12,28.74 66.12,28.03 65.75,27.66 58.78,27.66 58.32,28.12 58.32,28.69 58.7,29.07 64.92,29.07 65.48,29.63 66.3,29.63 66.6,29.33 66.6,29.32 66.47,29.19 66.4,29.19 66.37,29.16 | 54.81,26.92 54.26,27.47
  Top 0.61: C8.2 54,27.23 | 54,27.23 54.94,27.23 R28.2 55.18,26.98 S1.2 | v54,27.97 54,27.23 | 66.12,28.74 66.06,28.68 58.85,28.68 58.68,28.51 58.68,28.35 59.03,28.7 65.14,28.7 65.6,29.16 66.05,29.16 66.07,29.18 66.08,29.18
  Top 1.016: 65.09,27.97 v59.12,27.97
  Bottom 0.406: 54.07,28.08 54.48,27.67 | 54.48,27.67 54.69,27.67 | 54.69,27.67 59.63,27.67 59.63,28.43 59.36,28.7 53.84,28.7 53.63,28.49 53.63,27.85 53.81,27.67 54.48,27.67 | 54.69,27.67 53.94,28.42 53.94,28.46 53.99,28.51 59.27,28.51
  Bottom 1.016: v54,27.97 v59.12,27.97
VBUS  (via drill 0.3)  (2 unrouted)
  Top 0.254: IC1.8 47.68,33.2 D6.+ 47.75,34.57 C1.1 47.77,35.9 C2.1
  Top 0.406: J3.1 43.41,28.79 v43.29,28.92 | 47.41,35.72 47.41,33.57 47.12,33.28 47.45,32.95 47.45,32.27 47.91,32.27 48.24,32.6 48.24,36.44 47.46,36.44 47.41,36.39 47.41,35.72 | 47.41,35.72 47.71,35.42 47.71,33.84 47.95,33.6 47.95,35.35 48.01,35.41 48.01,32.78 48.09,32.7 | 43.13,26.02 43.13,26.06 43.4,26.33 43.4,28.8 43.42,28.82 43.42,29.01 43.27,29.16 42.59,29.16 42.51,29.08 42.51,26.14 42.67,25.98 43.38,25.98 43.13,26.23 42.87,26.23 42.83,26.27 42.83,28.89 42.87,28.85 43.07,28.85 43.1,28.82 43.1,26.26
  Top 0.61: v47.69,32.36 47.69,33.08 D6.+
  Bottom 0.813: v43.29,28.92 46.68,28.92 47.69,29.93 v47.69,32.36
VBUS1
  Top 0.254: IC1.16 C3.1
VCC  (via drill 0.3)  (2 unrouted)
  Top 0.254: U25.13 v58.59,39.46 | R1.2 56.28,39.67 C57.1 54.86,39.7 R90.2 R29.2
  Top 0.406: v63.48,45.91 | v58.59,39.46 57.81,39.46 R1.2
  Top 0.61: 52.99,39.71 53.09,39.71 53.33,39.95 57.94,39.95 58.23,39.66 | 59.51,39.65 58.27,39.65 58.05,39.43 53.13,39.43 | 52.91,39.43 53.13,39.43 | 53.13,39.43 53.25,39.55
  Top 0.813: v63.48,45.91 R76.1
  Bottom 0.406: 58.61,39.44 v58.59,39.46
  Bottom 0.813: 58.61,39.44 62.65,39.44 63.58,40.37 63.58,45.81 v63.48,45.91
VDD  (via drill 0.3)  (14 unrouted)
  Top 0.254: D6.- 50.75,33.14 U8.1 51.39,32.51 R22.1 52.15,30.48 52.92,29.72 55.75,29.72 56.67,28.8 R28.1 | 20.3,81.43 19.98,81.43 M4.1
  Top 0.406: 82.01,80.52 D4.C | 50.05,33.04 49.91,33.18 49.85,33.18 49.85,33.24 49.95,33.34 50.36,33.34 50.74,33.72 50.74,34.16 50.8,34.22 51.54,34.22 51.54,32.88 51.96,32.46 52.56,32.46 52.66,32.36 52.66,30.82 53.31,30.17 56.35,30.17 57.22,29.3 57.22,27.84 58.26,26.8 58.26,26.15 58.09,25.98 57.52,25.98 56.83,25.29 56.46,25.29 56.44,25.27 56.44,28.32 55.79,28.97 52.89,28.97 51.62,30.24 51.62,31.13 51.27,31.48 50.17,31.48 49.97,31.68 49.97,32.76 49.85,32.88 50.35,32.88 50.89,33.42 50.89,33.77 51.06,33.94 51.06,33.11 51.16,33.01 | 84.01,15.18 82.8,13.97 82.12,13.97 71.3,24.79 71.3,31.55 72.09,31.55 73.66,29.98 73.66,24.17 78.83,19 80.28,19 84.05,15.23 83.31,15.23 82.37,14.29 78.76,17.9 78.76,17.96 79.53,18.73 80.05,18.73 79.32,18 78.74,18
  Top 0.61: v58.07,26.5 57.36,26.5 R28.1 S1.3
  Top 0.813: D1.C 18.12,20.63 | 18.12,20.63 v23.78,26.29 23.78,26.42 23.23,26.97 22.97,26.97 13.34,17.34 13.34,16.47 | M1.1 15.29,17.8 16.36,18.87 | 16.36,18.87 18.12,20.63 | C9.2 16.94,18.29 16.36,18.87 | 73.77,70.39 82.01,78.63 | 82.01,78.63 82.01,80.52 D4.C | M2.1 84.71,81.33 84.21,80.83 | 84.21,80.83 82.01,78.63 | C11.2 84.21,80.85 84.21,80.83 | 80.25,18.26 80.35,18.26 83.31,15.3 83.31,14.95 82.34,15.92 81.75,15.92 80.28,17.39 80.28,17.74 | 15.33,16.54 18.53,19.74 18.53,21.03 17.72,20.22 17.72,19.42 15.48,17.18 15.48,16.99 | M4.1 16.71,84.7 C10.2 19.52,81.88 D2.C | 84.69,83.56 81.66,80.53 81.66,78.33 82.5,79.17 82.5,80.36 84.23,82.09 84.23,82.57 84.14,82.48 84.14,81.47 82.9,80.23 82.9,80.16 | 23.84,26.35 23.84,26.08 17.85,20.09 17.85,19.06 14.73,15.94 13.86,15.94 13.33,16.47 13.33,16.64 23.15,26.46 23.15,25.85 14.08,16.78 14.57,16.78 14.81,16.54 14.5,16.54 14.22,16.26 | 84.23,81.83 83.88,82.18 83.88,82.74 85.27,84.13 85.59,84.13 86.18,83.54 86.18,82.14 73.96,69.92 73.96,32.66 | 73.96,32.66 73.96,32.24 | 73.96,32.24 72.75,31.03 72.75,30.16 72.98,29.93 73.96,30.91 73.96,32.24 | 73.96,32.66 73.55,32.25 73.55,31.07 73.53,31.09 73.53,71.27 82.23,79.97 82.23,79.98 82.22,79.99 83.18,79.99 85.46,82.27 85.46,83.26 85.22,83.5 | 17.04,84.48 16.58,84.48 15.99,85.07 17.02,86.1 17.45,86.1 20.82,82.73 20.82,81.95 20.3,81.43 19.89,81.43 16.34,84.98 16.73,84.98 17.18,85.43 | 17.18,85.43 | 17.18,85.43 20.44,82.17 19.76,82.17 17.3,84.63 | 57.22,27.27 57.22,29.05 56.3,29.97 | 78.74,18 71.75,24.99 71.75,31.13 72.38,30.5 72.38,25.01
  Top 1.016: J2.1 73.77,32.72 73.77,70.39 | 51.16,33.01 51.16,32.51 50.6,31.95 50.6,32.35 50.36,32.59 50.87,32.59 51.47,31.99 51.56,31.99 52.08,31.47 52.08,30.61 53.17,29.52 56.06,29.52 56.63,28.95 56.63,28.7 56.86,28.47 56.86,27.41 57.74,26.53 57.37,26.53 57.15,26.31 57.18,26.28 | 73.04,31.46 73.04,27.28 v73.04,26.23 73.04,24.68 79.4,18.32 79.4,17.98 82.86,14.52 | R30.1 26.75,74.66 v26.27,75.14
  Bottom 0.254: 30.6,26.72 30.54,26.78 23.12,26.78 22.84,26.5 22.84,25.74 23.07,25.51 58.67,25.51 58.85,25.69 58.85,26.52 58.59,26.78 56.57,26.78 56.8,26.55 58.49,26.55 58.65,26.39 58.65,26.35 58.66,26.34 58.66,25.71 58.51,25.86 58.51,26.01 | 58,25.83 58.32,25.51 73.31,25.51 73.47,25.67 73.47,26.58 73.27,26.78 58.29,26.78 58.51,26.56 73.18,26.56 73.27,26.47 73.27,25.73 59.07,25.73 59.04,25.7 59.04,26.23 59.05,26.24 72.78,26.24 73.06,25.96 59.18,25.96 59.14,25.92 59.14,25.99 59.19,26.04 73.15,26.04 73.21,26.1
  Bottom 0.406: 58.85,26.52 72.75,26.52 v73.04,26.23
  Bottom 0.813: 26.27,26.88 26.27,26.59 26.18,26.5 | 24.73,26.5 23.99,26.5 v23.78,26.29 | 24.96,26.5 26.18,26.5 | 26.18,26.5 v58.07,26.5 | 26.25,27.79 24.96,26.5 | 24.96,26.5 24.73,26.5 | 24.73,26.5 24.74,26.51 27.65,26.51 | 27.88,26.51 27.65,26.51 | 27.65,26.51 26.3,27.86 | 58.51,26.01 23.35,26.01 23.29,25.95 23.29,26.24 23.35,26.3
  Bottom 1.143: 26.27,74.43 26.27,26.88
  Bottom 1.27: 26.27,26.88 26.27,26.9 26.3,26.93 | v26.27,75.14 26.27,75.05 26.3,75.02
  Bottom 1.422: M4.1 v26.27,75.14 26.27,74.43
VIO  (via drill 0.3)
  Top 0.254: U25.8 62.24,41.07 v62.56,41.39
  Top 0.406: R90.1 v53.7,41.45 v53.7,41.46 | v62.56,41.39 64.51,41.39 65,41.88 C58.1
  Bottom 0.406: v53.7,41.46 62.49,41.46 v62.56,41.39

### Text on the board
tPlace: GND | VDD | VDD | GND | IO23 | IO36 | IO22 | IO39 | IO21 | IO34 | IO35 | IO19 | IO32 | IO18 | IO5 | IO33 | IO17 | IO25 | IO16 | IO26 | IO4 | IO27 | IO0 | IO14 | IO12 | IO2 | IO13 | X | IO15 | Z | TXD | GND | RST | Y | RXD | GND | GND | 5V0 | V+ | 3V3 | V- | OFF | ON | VDD | GND | GND | VDD
bPlace: ESP32 IMU Module V1.1 | www.makerfabs.com
tNames: U1